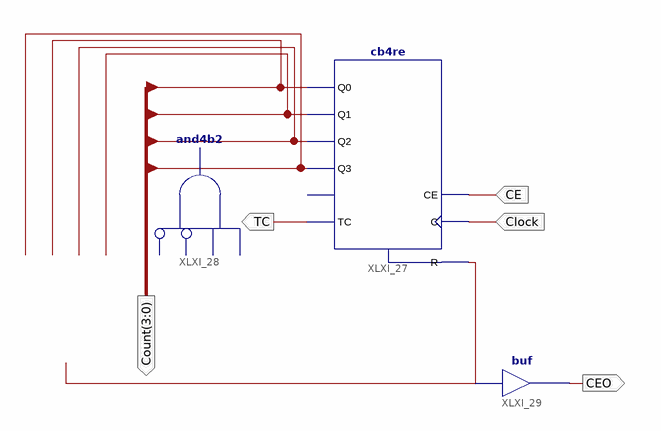
[diagram p0: schematic sheet 1]
// Xilinx ISE schematic Counter0_9.sch (spartan6) as structural Verilog: 3 symbols, 5 ports
module Counter0_9 (
  input  Clock,
  input  CE,
  output TC,
  output [3:0] Count,
  output CEO
);

  wire XLXN_26;

  cb4re XLXI_27 (
    .C(Clock), .CE(CE), .R(XLXN_26), .Q0(Count[0]), .Q1(Count[1]), .Q2(Count[2]), .Q3(Count[3]), .TC(TC));  // open: CEO
  and XLXI_28 (XLXN_26, ~Count[1], ~Count[2], Count[0], Count[3]);  // and4b2
  buf XLXI_29 (CEO, XLXN_26);
endmodule
